# EAGLE design Cisco-Console-CP2102-Piggyback-v2 (EAGLE 9.5.2)
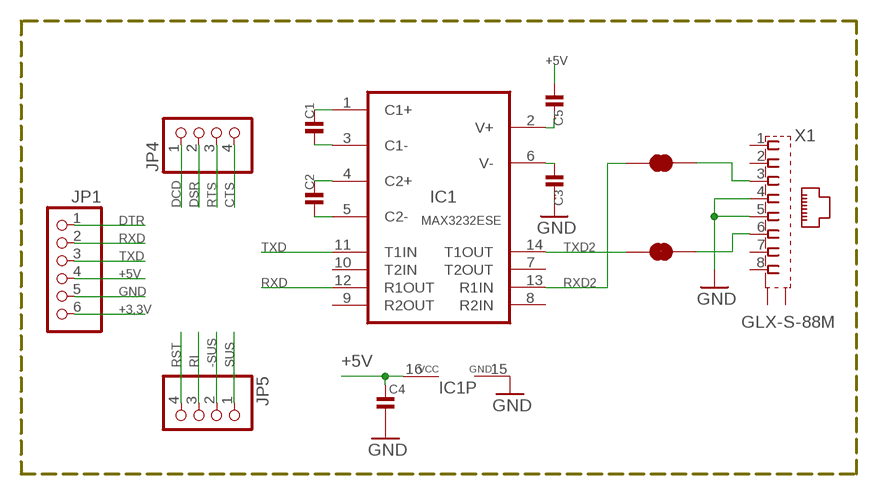
[diagram p0: schematic, sheet 1]

## Parts
C1  MICROBUILDER_CAP_CERAMIC0402  [MICROBUILDER_0402]
C2  MICROBUILDER_CAP_CERAMIC0402  [MICROBUILDER_0402]
C3  MICROBUILDER_CAP_CERAMIC0402  [MICROBUILDER_0402]
C4  MICROBUILDER_CAP_CERAMIC0402  [MICROBUILDER_0402]
C5  MICROBUILDER_CAP_CERAMIC0402  [MICROBUILDER_0402]
IC1  MAX3232ESE  [SO16]
JP1  PINHD-1X6  [1X06]
JP4  PINHD-1X4  [1X04]
JP5  PINHD-1X4  [1X04]
JP6  JUMPER-SMT_2_NC_TRACE_NO-SILK  [SMT-JUMPER_2_NC_TRACE_NO-SILK]
JP9  JUMPER-SMT_2_NC_TRACE_NO-SILK  [SMT-JUMPER_2_NC_TRACE_NO-SILK]
X1  GLX-S-88M  [GLX-S-88M]

## Nets
+3,3V: JP1.6
+5V: C4.1 C5.1 IC1.16(VCC) JP1.4
-SUS: JP5.2
CTS: JP4.4
DCD: JP4.1
DSR: JP4.2
DTR: JP1.1
GND: C3.2 C4.2 IC1.15(GND) JP1.5 X1.4 X1.5
N$1: C5.2 IC1.2(V+)
N$3: JP6.2 X1.3
N$6: JP9.2 X1.6
N$9: C3.1 IC1.6(V-)
N$11: C2.1 IC1.4(C2+)
N$12: C2.2 IC1.5(C2-)
N$13: C1.2 IC1.3(C1-)
N$14: C1.1 IC1.1(C1+)
RI: JP5.3
RST: JP5.4
RTS: JP4.3
RXD: IC1.12(R1OUT) JP1.2
RXD2: IC1.13(R1IN) JP6.1
SUS: JP5.1
TXD: IC1.11(T1IN) JP1.3
TXD2: IC1.14(T1OUT) JP9.1
Unconnected: IC1.7(T2OUT) IC1.8(R2IN) IC1.9(R2OUT) IC1.10(T2IN) X1.1 X1.2 X1.7 X1.8 X1.S1 X1.S2

## Library data of the parts
C1-C5 = Adafruit_ADS1015_12Bit_I2C_ADC:MICROBUILDER_CAP_CERAMIC: Ceramic Capacitors 0402 - 0402 Surface Mount Capacitors 16pF 50V 5% [Digikey: 445-4899-2-ND] 18pF 50V 5% [Digikey: 490-1281-2-ND] 22pF 50V 5% [Digikey: 490-1283-2-ND] 68pF 50V 5% [Digikey: 490-1289-2-ND] 0.1uF 10V 10% [Digikey: 490-1318-2-ND] 1.0uF 6.3V 10% [Digikey: 490-1320-2-ND] 0603 - 0603 Surface Mount Capacitors 16 pF 50V 5% [Digikey: 445-5051-2-ND] 22 pF 50V [Digikey: PCC220ACVTR-ND] 33 pF 50V 5% [Digikey: 490-1415-1-ND] 56pF 50V 5% [Digikey: 490-1421-1-ND] 220pF 50V 5% [Digikey: 445-1285-1-ND] 680 pF 50V 2200 pF 50V 5% C0G [Digikey: 445-1297-1-ND] 5600 pF 100V 5% X7R [Digikey: 478-3711-1-ND] 0.1 µF 25V 10% [Digikey: PCC2277TR-ND] 0.22 µF 16V 10% X7R [Digikey: 445-1318-1-ND] 1.0 µF 25V 10% [Digikey: 445-5146-2-ND] 0603 - RF Specific 3pF 250V +/-0.1pF RF [Digikey: 712-1347-1-ND] 18 pF 250V 5% [Digikey: 478-3505-1-ND or 712-1322-1-ND] 56 pF 250V 5% C0G RF [Digikey: 490-4867-1-ND] 68 pF 250V RF [Digikey: 490-4868-1-ND] 0805 - 0805 Surface Mount Capacitors 220 pF 250V 2% RF Ceramic Capacitor [Digikey: 712-1398-1-ND] 1000 pF 50V 2% NP0 Ceramic Capacitor [Digikey: 478-3760-1-ND] 0.1 µF 25V 10% Ceramic Capacitor [Digikey: PCC1828TR-ND] 1.0 µF 16V 10% Ceramic Capacitor[Digikey: 490-1691-2-ND] 10.0 µF 10V 10% Ceramic Capacitor[Digikey: 709-1228-1-ND] 10.0 uF 16V 10% Ceramic Capacitor [Digikey: 478-5165-2-ND] 47 uF 6.3V 20% Ceramic Capacitor [Digikey: 587-1779-1-ND or 399-5506-1-ND] 1206 - 1206 Surface Mount Capacitors 47uF 10V 20% Ceramic Capacitor [Digikey: 490-5528-1-ND or 399-5508-1-ND or 445-6010-1-ND] 100uF 6.3V -20%, +80% Y5V Ceramic Capacitor (Digikey: 490-4512-1-ND, Mouser: 81-GRM31CF50J107ZE1L)
IC1 = maxim:MAX3232*: True RS-232 Transceivers 3.0V to 5.5V, Low-Power up to 1Mbps, Using Four 0.1µF External Capacitors Source: http://pdfserv.maxim-ic.com/en/ds/MAX3222-MAX3241.pdf; MF: MAXIM; MPN: MAX3232ESE; OC_FARNELL: 9725539; OC_NEWARK: 79C3880
JP1 = pinhead:PINHD-1X6: PIN HEADER
JP4 JP5 = pinhead:PINHD-1X4: PIN HEADER
JP6 JP9 = SparkFun-Jumpers:JUMPER-SMT_2_NC_TRACE: Normally closed trace jumper This jumper has a trace between two pads so it's normally closed (NC). Use a razor knife to open the connection. For best results follow the IPC guidelines for cutting traces: Cutout at least 0.063 mm (0.005 in). Remove all loose material to clean up the cut area. Seal the cut with an approved epoxy. Reapply solder to reclose the connection.
X1 = con-kycon:GLX-S-88M: Mod. Jack, Right Angle, 8 posiotion, 8 contatcs RJ45 Source: GLX-S-88M.pdf; OC_FARNELL: unknown; OC_NEWARK: unknown

## Board
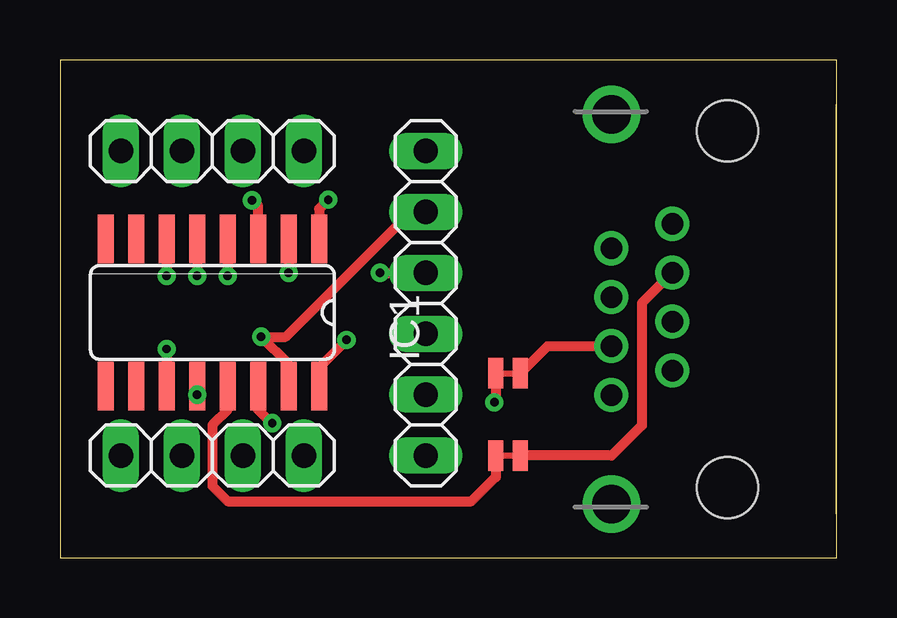
[diagram p1: board, top side]
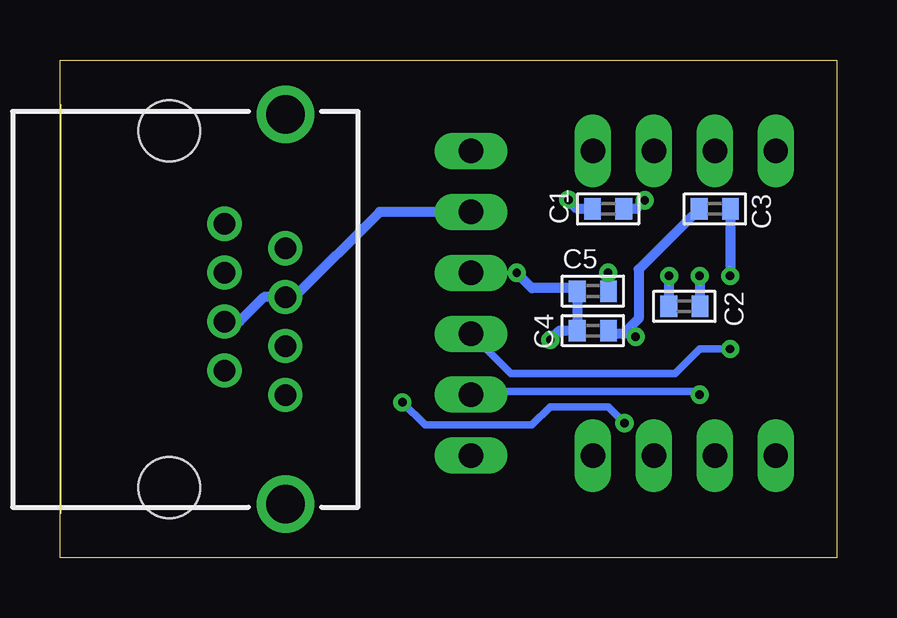
[diagram p2: board, bottom side, seen from below]

Size 32.37 x 20.75 mm. Coordinates in mm from the lower left corner, seen from the top.
Outline: 0,0 32.37,0 32.37,20.75 0,20.75 0,0
Copper layers (1*16): Top 0.035mm / dielectric 1.5mm / Bottom 0.035mm
Design rules "default": minimum track width 6mil, minimum drill 0.35mm, track to track 6mil, track to pad 6mil, pad to pad 6mil, via to via 6mil, smd to smd 6mil, copper to edge 40mil, drill to drill 6mil, minimum pad ring 10mil, minimum via ring 8mil, stop-mask expansion 4mil, vias tented up to drill 0mil, thermal gap 10mil

### Footprints (pad centres in the part's own frame; a part is rotated, then mirrored left to right if it is on the bottom)
MICROBUILDER_0402 = smd 0.7 x 0.9: 1 -0.65,0; 2 0.65,0
SO16 = smd 0.66 x 2.032: 1 -4.445,-3.073; 2 -3.175,-3.073; 3 -1.905,-3.073; 4 -0.635,-3.073; 5 0.635,-3.073; 6 1.905,-3.073; 7 3.175,-3.073; 8 4.445,-3.073; 9 4.445,3.073; 10 3.175,3.073; 11 1.905,3.073; 12 0.635,3.073; 13 -0.635,3.073; 14 -1.905,3.073; 15 -3.175,3.073; 16 -4.445,3.073
1X06 = drill 1.016 long: 1 -6.35,0; 2 -3.81,0; 3 -1.27,0; 4 1.27,0; 5 3.81,0; 6 6.35,0
1X04 = drill 1.016 long: 1 -3.81,0; 2 -1.27,0; 3 1.27,0; 4 3.81,0
SMT-JUMPER_2_NC_TRACE_NO-SILK = smd 0.635 x 1.27: 1 -0.508,0; 2 0.508,0
GLX-S-88M = drill 0.9 pad 1.422: 1 -3.57,-2.3; 2 -2.55,-4.84; 3 -1.53,-2.3; 4 -0.51,-4.84; 5 0.51,-2.3; 6 1.53,-4.84; 7 2.55,-2.3; 8 3.57,-4.84 | drill 1.6 pad 2.184: S1 -8.125,-4.84; S2 8.125,-4.84 | hole 2.55: -7.44,0; 7.44,0

### Placement (x,y rotation side)
C1  9.53,14.54 0 bottom
C2  6.35,10.48 0 bottom
C3  5.08,14.54 180 bottom
C4  10.16,9.46 0 bottom
C5  10.16,11.11 0 bottom
IC1  6.35,10.22 180 top
JP1  15.24,10.6 90 top
JP4  6.35,4.25 0 top
JP5  6.35,16.95 0 top
JP6  18.67,4.25 0 top
JP9  18.67,7.68 0 top
X1  27.81,10.35 270 top

### Tracks (layer width: path | path; a pad name or v marks a point on that pad's centre or on a via)
+5V  (via drill 0.35)
  Top 0.152: IC1.16 10.79,7.94
  Top 0.406: 10.79,7.94 v11.94,9.08 | v13.34,11.87 JP1.4
  Bottom 0.152: C5.1 10.94,11.24
  Bottom 0.406: C5.1 C4.1 11.56,9.46 v11.94,9.08 | v13.34,11.87 12.7,11.24 10.94,11.24
GND  (via drill 0.35)
  Top 0.152: 9.53,8.06 IC1.15
  Top 0.406: 9.53,8.06 v8.38,9.21 9.4,9.21 14.61,14.41 JP1.5
  Bottom 0.152: 8.89,9.33 8.76,9.21 v8.38,9.21 | C4.2 9.38,9.33
  Bottom 0.406: C3.2 8.26,12.02 8.26,9.97 8.89,9.33 9.38,9.33 | JP1.5 19.05,14.41 22.6,10.86 X1.4 23.87,10.86 24.89,9.84 X1.5
N$1  (via drill 0.35)
  Top 0.406: IC1.2 v9.53,11.87
  Bottom 0.152: 9.53,11.13 C5.2
  Bottom 0.406: v9.53,11.87 9.53,11.13
N$3
  Top 0.406: X1.3 24.24,10.61 24.24,5.51 22.99,4.25 JP6.2
N$6
  Top 0.406: JP9.2 20.31,8.82 X1.6
N$9  (via drill 0.35)
  Top 0.406: IC1.6 v4.45,11.75
  Bottom 0.406: v4.45,11.75 4.43,11.76 C3.1
N$11  (via drill 0.35)
  Top 0.406: IC1.4 v6.99,11.75
  Bottom 0.152: C2.1 6.99,10.49
  Bottom 0.406: 6.99,10.49 v6.99,11.75
N$12  (via drill 0.35)
  Top 0.406: IC1.5 v5.71,11.75
  Bottom 0.152: 5.71,10.49 C2.2
  Bottom 0.406: v5.71,11.75 5.71,10.49
N$13  (via drill 0.35)
  Top 0.152: 8.02,14.9 v8,14.9
  Top 0.406: IC1.3 8.26,14.67 8.02,14.9
  Bottom 0.406: v8,14.9 8.13,14.77 8.14,14.77 8.37,14.54 C1.2
N$14  (via drill 0.35)
  Top 0.406: v11.18,14.92 10.79,14.54 IC1.1
  Bottom 0.406: v11.18,14.92 11.06,14.81 11.06,14.8 10.81,14.54 C1.1
RXD  (via drill 0.35)
  Top 0.254: v5.71,6.79 IC1.12
  Bottom 0.305: JP1.2 15.11,6.92 5.84,6.92 v5.71,6.79
RXD2
  Top 0.406: JP6.1 18.16,3.37 17.14,2.35 6.99,2.35 6.35,2.98 6.35,5.52 6.99,6.16 IC1.13
TXD  (via drill 0.35)
  Top 0.406: v4.45,8.7 IC1.11
  Bottom 0.305: JP1.3 13.59,7.68 6.73,7.68 5.71,8.7 v4.45,8.7
TXD2  (via drill 0.35)
  Top 0.152: IC1.14 8.26,6.16
  Top 0.406: JP9.1 18.16,6.54 v18.1,6.48 | 8.26,6.16 8.83,5.59 v8.85,5.61
  Bottom 0.305: v8.85,5.61 9.53,6.29 11.94,6.29 12.7,5.52 17.14,5.52 v18.1,6.48